# Altium schematic sheet IF.SchDoc
size A3
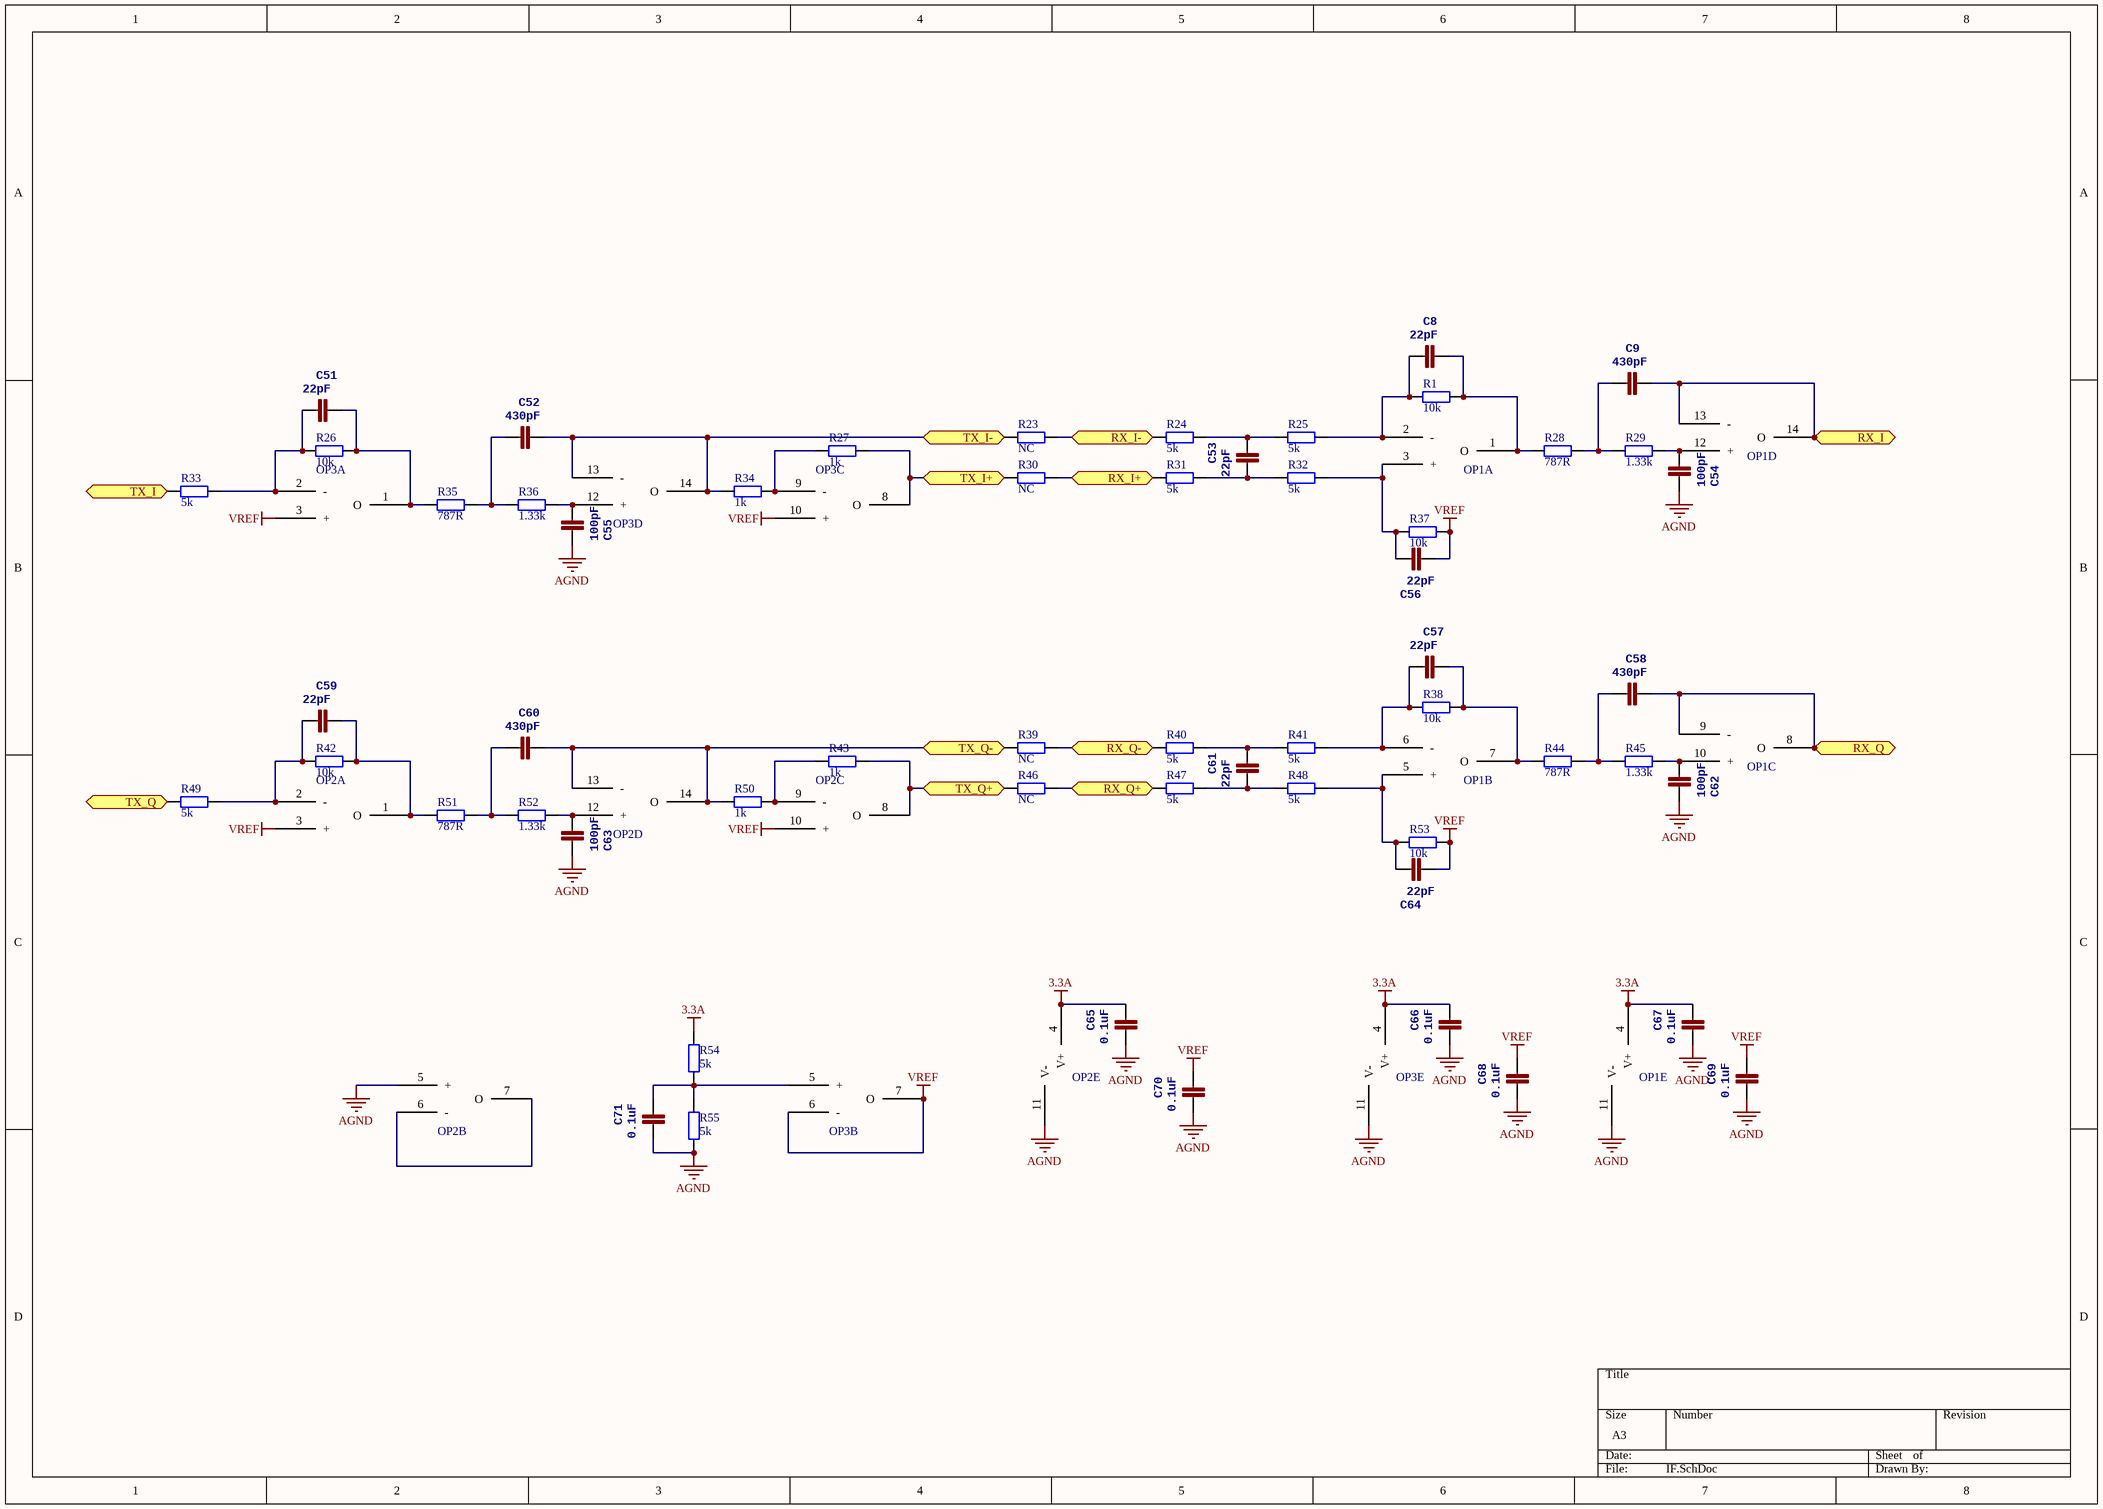
[diagram p0: IF.SchDoc]

## Parts
C8  22pF  [0402]
C9  430pF  [0402]
C51  22pF  [0402]
C52  430pF  [0402]
C53  22pF  [0402]
C54  100pF  [0402]
C55  100pF  [0402]
C56  22pF  [0402]
C57  22pF  [0402]
C58  430pF  [0402]
C59  22pF  [0402]
C60  430pF  [0402]
C61  22pF  [0402]
C62  100pF  [0402]
C63  100pF  [0402]
C64  22pF  [0402]
C65  0.1uF  [0402]
C66  0.1uF  [0402]
C67  0.1uF  [0402]
C68  0.1uF  [0402]
C69  0.1uF  [0402]
C70  0.1uF  [0402]
C71  0.1uF  [0402]
OP1  MCP6024  (value not drawn)  (parts A,B,C,D,E of 5)
OP2  MCP6024  (value not drawn)  (parts A,B,C,D,E of 5)
OP3  MCP6024  (value not drawn)  (parts A,B,C,D,E of 5)
R1  10k  [0402]
R23  NC  [0402]
R24  5k  [0402]
R25  5k  [0402]
R26  10k  [0402]
R27  1k  [0402]
R28  787R  [0402]
R29  1.33k  [0402]
R30  NC  [0402]
R31  5k  [0402]
R32  5k  [0402]
R33  5k  [0402]
R34  1k  [0402]
R35  787R  [0402]
R36  1.33k  [0402]
R37  10k  [0402]
R38  10k  [0402]
R39  NC  [0402]
R40  5k  [0402]
R41  5k  [0402]
R42  10k  [0402]
R43  1k  [0402]
R44  787R  [0402]
R45  1.33k  [0402]
R46  NC  [0402]
R47  5k  [0402]
R48  5k  [0402]
R49  5k  [0402]
R50  1k  [0402]
R51  787R  [0402]
R52  1.33k  [0402]
R53  10k  [0402]
R54  5k  [0402]
R55  5k  [0402]

## Ports
RX_I, RX_I+, RX_I-, RX_Q, RX_Q+, RX_Q-, TX_I, TX_I+, TX_I-, TX_Q, TX_Q+, TX_Q-

## Nets
3.3A: C65.1 C66.1 C67.1 OP1.4(V+) OP2.4(V+) OP3.4(V+) R54.1
AGND: C54.1 C55.1 C62.1 C63.1 C65.2 C66.2 C67.2 C68.2 C69.2 C70.2 C71.2 OP1.11(V-) OP2.5(+) OP2.11(V-) OP3.11(V-) R55.2
VREF: C56.2 C64.2 C68.1 C69.1 C70.1 OP2.3(+) OP2.10(+) OP3.3(+) OP3.6(-) OP3.7(O) OP3.10(+) R37.1 R53.1
RX_I: C9.1 OP1.13(-) OP1.14(O) ; port RX_I
RX_I+: R30.1 R31.2 ; port RX_I+
RX_I-: R23.1 R24.2 ; port RX_I-
RX_Q: C58.1 OP1.8(O) OP1.9(-) ; port RX_Q
RX_Q+: R46.1 R47.2 ; port RX_Q+
RX_Q-: R39.1 R40.2 ; port RX_Q-
TX_I: R33.2 ; port TX_I
TX_I+: OP3.8(O) R27.1 R30.2 ; port TX_I+
TX_I-: C52.1 OP3.13(-) OP3.14(O) R23.2 R34.2 ; port TX_I-
TX_Q: R49.2 ; port TX_Q
TX_Q+: OP2.8(O) R43.1 R46.2 ; port TX_Q+
TX_Q-: C60.1 OP2.13(-) OP2.14(O) R39.2 R50.2 ; port TX_Q-
NetC8_1: C8.1 OP1.1(O) R1.1 R28.2
NetC8_2: C8.2 OP1.2(-) R1.2 R25.1
NetC9_2: C9.2 R28.1 R29.2
NetC51_1: C51.1 OP3.1(O) R26.1 R35.2
NetC51_2: C51.2 OP3.2(-) R26.2 R33.1
NetC52_2: C52.2 R35.1 R36.2
NetC53_1: C53.1 R24.1 R25.2
NetC53_2: C53.2 R31.1 R32.2
NetC54_2: C54.2 OP1.12(+) R29.1
NetC55_2: C55.2 OP3.12(+) R36.1
NetC56_1: C56.1 OP1.3(+) R32.1 R37.2
NetC57_1: C57.1 OP1.7(O) R38.1 R44.2
NetC57_2: C57.2 OP1.6(-) R38.2 R41.1
NetC58_2: C58.2 R44.1 R45.2
NetC59_1: C59.1 OP2.1(O) R42.1 R51.2
NetC59_2: C59.2 OP2.2(-) R42.2 R49.1
NetC60_2: C60.2 R51.1 R52.2
NetC61_1: C61.1 R40.1 R41.2
NetC61_2: C61.2 R47.1 R48.2
NetC62_2: C62.2 OP1.10(+) R45.1
NetC63_2: C63.2 OP2.12(+) R52.1
NetC64_1: C64.1 OP1.5(+) R48.1 R53.2
NetC71_1: C71.1 OP3.5(+) R54.2 R55.1
NetOP2_6: OP2.6(-) OP2.7(O)
NetOP2_9: OP2.9(-) R43.2 R50.1
NetOP3_9: OP3.9(-) R27.2 R34.1

## Library data of the parts
C8 C9 C51-C71 = CAP0402-CAP: <b>Capacitor</b> / Standard 0603 ceramic capacitor, and 0.1" leaded capacitor.; PARTNO: CC0402ZRY5V7BB104
OP1-OP3 = OP-SOP14
R1 R23-R55 = Res2: Resistor; Published: 8-Jun-2000; LatestRevisionDate: 17-Jul-2002; LatestRevisionNote: Re-released for DXP Platform.; PackageReference: AXIAL-0.4; Publisher: Altium Limited; PackageDescription: Axial Device, Thru-Hole; 2 Leads; 0.4 in Pin Spacing